# EAGLE schematic openEMSstim_02 (EAGLE 7.6.0)
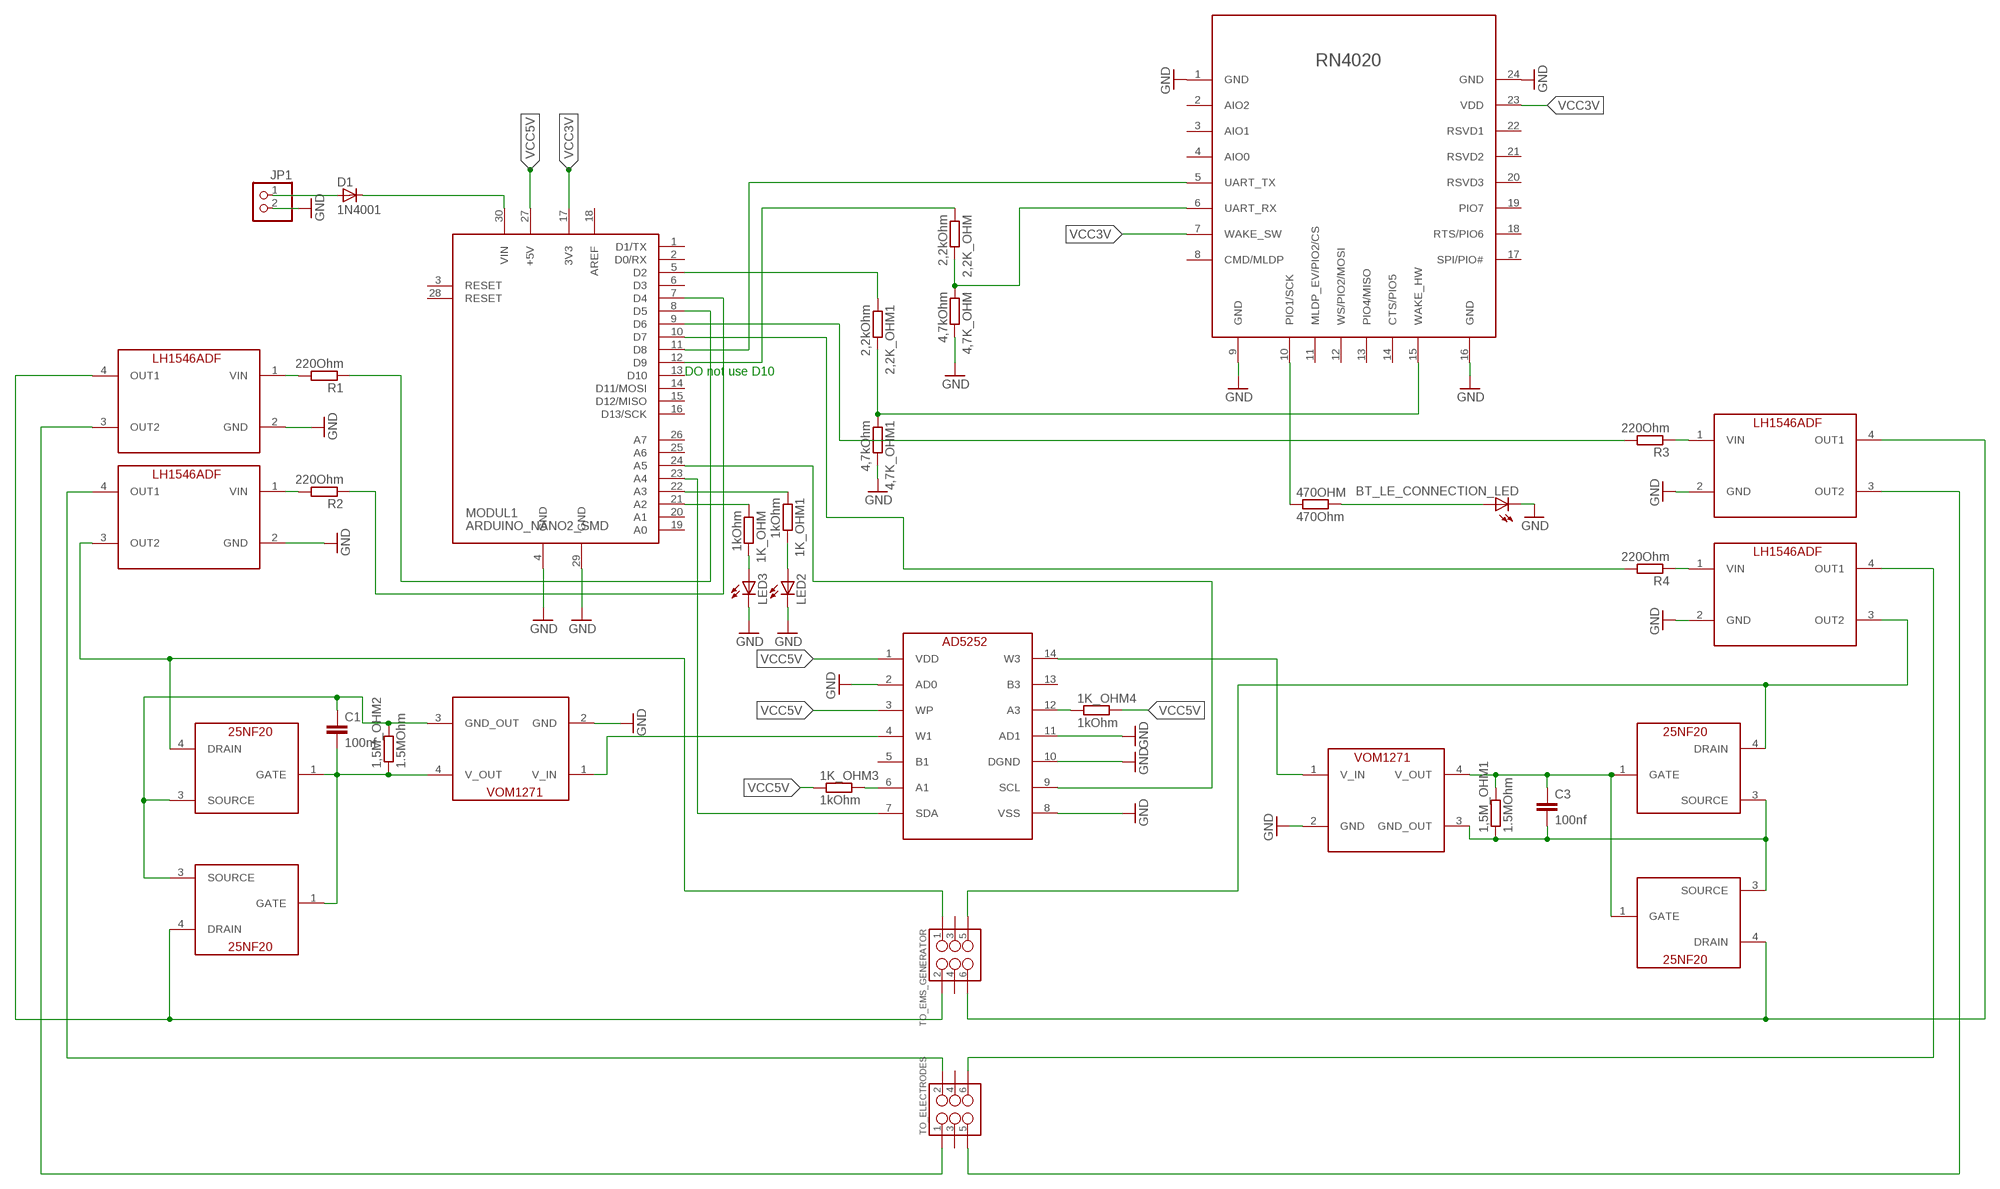
[diagram p0: schematic, sheet 1]

## Parts
1,5M_OHM1  1.5MOhm  R-EU_R0805  [R0805]
1,5M_OHM2  1.5MOhm  R-EU_R0805  [R0805]
1K_OHM  1kOhm  R-EU_R0805  [R0805]
1K_OHM1  1kOhm  R-EU_R0805  [R0805]
1K_OHM3  1kOhm  R-EU_R0805  [R0805]
1K_OHM4  1kOhm  R-EU_R0805  [R0805]
2,2K_OHM  2,2kOhm  R-EU_R0805  [R0805]
2,2K_OHM1  2,2kOhm  R-EU_R0805  [R0805]
4,7K_OHM  4,7kOhm  R-EU_R0805  [R0805]
4,7K_OHM1  4,7kOhm  R-EU_R0805  [R0805]
470OHM  470Ohm  R-EU_R0805  [R0805]
BT_LE_CONNECTION_LED  LEDCHIPLED_0603  [CHIPLED_0603]
C1  100nf  CAP0805  [0805]
C3  100nf  CAP0805  [0805]
D1  1N4001  D-SMB  [SMB]
JP1  PINHD-1X2  [1X02]
LED2  LEDCHIPLED_0603  [CHIPLED_0603]
LED3  LEDCHIPLED_0603  [CHIPLED_0603]
MODUL1  ARDUINO_NANO2_SMD  [ARDUINO_NANO2_SMD]
MOS01  DEV  [PACK]
MOS02  DEV  [PACK]
MOS03  DEV  [PACK]
MOS04  DEV  [PACK]
R1  220Ohm  R-EU_R0805  [R0805]
R2  220Ohm  R-EU_R0805  [R0805]
R3  220Ohm  R-EU_R0805  [R0805]
R4  220Ohm  R-EU_R0805  [R0805]
TO_ELECTRODES  M03X2  [RIGHT_ANGLED_SHROUED_2X06_6PIN]
TO_EMS_GENERATOR  M03X2  [RIGHT_ANGLED_SHROUED_2X06_6PIN]
U$5  RN4020  [RN4020]
U$6  AD5252  [TSSOP]
U$9  VOM1271  [SOP04]
U$10  VOM1271  [SOP04]
U$11  LH1546ADF  [DIP04-SMD]
U$12  LH1546ADF  [DIP04-SMD]
U$13  LH1546ADF  [DIP04-SMD]
U$14  LH1546ADF  [DIP04-SMD]

## Nets
GND: 4,7K_OHM1.2 4,7K_OHM.2 BT_LE_CONNECTION_LED.C JP1.2 LED2.C LED3.C MODUL1.4(GND) MODUL1.29(GND) U$5.1(GND) U$5.9(GND) U$5.16(GND) U$5.24(GND) U$6.2(AD0) U$6.8(VSS) U$6.10(DGND) U$6.11(AD1) U$9.2(GND) U$10.2(GND) U$11.2(GND) U$12.2(GND) U$13.2(GND) U$14.2(GND)
N$1: U$6.4(W1) U$9.1(V_IN)
N$2: 1K_OHM.1 MODUL1.21(A2)
N$3: MODUL1.23(A4) U$6.7(SDA)
N$4: TO_ELECTRODES.6 U$14.4(OUT1)
N$5: 2,2K_OHM.2 4,7K_OHM.1 U$5.6(UART_RX)
N$6: 2,2K_OHM.1 MODUL1.12(D9)
N$7: TO_ELECTRODES.1 U$11.3(OUT2)
N$8: 1,5M_OHM2.1 C1.2 MOS01.1(GATE) MOS02.1(GATE) U$9.4(V_OUT)
N$9: MODUL1.11(D8) U$5.5(UART_TX)
N$10: MODUL1.24(A5) U$6.9(SCL)
N$11: D1.1(C) MODUL1.30(VIN)
N$12: R2.2 U$12.1(VIN)
N$13: TO_ELECTRODES.2 U$12.4(OUT1)
N$14: R1.2 U$11.1(VIN)
N$15: R3.1 U$13.1(VIN)
N$16: R4.1 U$14.1(VIN)
N$17: MODUL1.8(D5) R1.1
N$18: MODUL1.7(D4) R2.1
N$19: MODUL1.9(D6) R3.2
N$20: MODUL1.10(D7) R4.2
N$21: MOS01.4(DRAIN) TO_EMS_GENERATOR.1 U$12.3(OUT2)
N$22: U$6.14(W3) U$10.1(V_IN)
N$23: 1,5M_OHM1.2 C3.1 MOS03.1(GATE) MOS04.1(GATE) U$10.4(V_OUT)
N$24: 1,5M_OHM1.1 C3.2 MOS03.3(SOURCE) MOS04.3(SOURCE) U$10.3(GND_OUT)
N$26: 1K_OHM4.1 U$6.12(A3)
N$27: 1,5M_OHM2.2 C1.1 MOS01.3(SOURCE) MOS02.3(SOURCE) U$9.3(GND_OUT)
N$28: MOS03.4(DRAIN) TO_EMS_GENERATOR.5 U$14.3(OUT2)
N$30: MOS02.4(DRAIN) TO_EMS_GENERATOR.2 U$11.4(OUT1)
N$31: TO_ELECTRODES.5 U$13.3(OUT2)
N$32: MOS04.4(DRAIN) TO_EMS_GENERATOR.6 U$13.4(OUT1)
N$33: 2,2K_OHM1.2 4,7K_OHM1.1 U$5.15(WAKE_HW)
N$34: 1K_OHM3.2 U$6.6(A1)
N$35: 2,2K_OHM1.1 MODUL1.5(D2)
N$36: 470OHM.1 U$5.10(PIO1/SCK)
N$37: 470OHM.2 BT_LE_CONNECTION_LED.A
N$39: 1K_OHM1.2 LED2.A
N$40: 1K_OHM1.1 MODUL1.22(A3)
N$42: 1K_OHM.2 LED3.A
N$63: D1.2(A) JP1.1
VCC3V: MODUL1.17(3V3) U$5.7(WAKE_SW) U$5.23(VDD)
VCC5V: 1K_OHM3.1 1K_OHM4.2 MODUL1.27(+5V) U$6.1(VDD) U$6.3(WP)
Unconnected: MODUL1.1(D1/TX) MODUL1.2(D0/RX) MODUL1.3(RESET) MODUL1.6(D3) MODUL1.13(D10) MODUL1.14(D11/MOSI) MODUL1.15(D12/MISO) MODUL1.16(D13/SCK) MODUL1.19(A0) MODUL1.20(A1) MODUL1.25(A6) MODUL1.26(A7) MODUL1.28(RESET) TO_ELECTRODES.3 TO_ELECTRODES.4 TO_EMS_GENERATOR.3 TO_EMS_GENERATOR.4 U$5.2(AIO2) U$5.3(AIO1) U$5.4(AIO0) U$5.8(CMD/MLDP) U$5.11(MLDP_EV/PIO2/CS) U$5.12(WS/PIO2/MOSI) U$5.13(PIO4/MISO) U$5.14(CTS/PIO5) U$5.17(SPI/PIO#) U$5.18(RTS/PIO6) U$5.19(PIO7) U$5.20(RSVD3) U$5.21(RSVD2) U$5.22(RSVD1) U$6.5(B1) U$6.13(B3)

## Notes on the sheet
- DO not use D10

## Power pins joined to a net without a drawn wire
AREF: MODUL1.18(AREF)

## Library data of the parts
1,5M_OHM1 1,5M_OHM2 1K_OHM 1K_OHM1 1K_OHM3 1K_OHM4 2,2K_OHM 2,2K_OHM1 4,7K_OHM 4,7K_OHM1 470OHM R1-R4 = resistor:R-EU_: RESISTOR, European symbol
BT_LE_CONNECTION_LED LED2 LED3 = adafruit:LED: LED OSRAM: - CHIPLED LG R971, LG N971, LY N971, LG Q971, LY Q971, LO R971, LY R971 LH N974, LH R974 LS Q976, LO Q976, LY Q976 LO Q996 - Hyper CHIPLED LW Q18S LB Q993, LB Q99A, LB R99A - SideLED LS A670, LO A670, LY A670, LG A670, LP A670 LB A673, LV A673, LT A673, LW A673 LH A674 LY A675 LS A676, LA A676, LO A676, LY A676, LW A676 LS A679, LY A679, LG A679 - Hyper Micro SIDELED® LS Y876, LA Y876, LO Y876, LY Y876 LT Y87S - SmartLED LW L88C, LW L88S LB L89C, LB L89S, LG L890 LS L89K, LO L89K, LY L89K LS L896, LA L896, LO L896, LY L896 - TOPLED LS T670, LO T670, LY T670, LG T670, LP T670 LSG T670, LSP T670, LSY T670, LOP T670, LYG T670 LG T671, LOG T671, LSG T671 LB T673, LV T673, LT T673, LW T673 LH T674 LS T676, LA T676, LO T676, LY T676, LB T676, LH T676, LSB T676, LW T676 LB T67C, LV T67C, LT T67C, LS T67K, LO T67K, LY T67K, LW E67C LS E67B, LA E67B, LO E67B, LY E67B, LB E67C, LV E67C, LT E67C LW T67C LS T679, LY T679, LG T679 LS T770, LO T770, LY T770, LG T770, LP T770 LB T773, LV T773, LT T773, LW T773 LH T774 LS E675, LA E675, LY E675, LS T675 LS T776, LA T776, LO T776, LY T776, LB T776 LHGB T686 LT T68C, LB T68C - Hyper Mini TOPLED® LB M676 - Mini TOPLED Santana® LG M470 LS M47K, LO M47K, LY M47K Source: http://www.osram.convergy.de/
C1 C3 = SparkFun-Passives:CAP: Capacitor Standard 0603 ceramic capacitor, and 0.1" leaded capacitor.
D1 = semicon-smd-ipc:D-: DIODE unfilled
JP1 = pinhead:PINHD-1X2: PIN HEADER
MODUL1 = arduino:ARDUINO_NANO2_SMD
MOS01-MOS04 = Tim:DEV
TO_ELECTRODES TO_EMS_GENERATOR = Tim:M03X2: 2x3 .1" header. Shrouded, with keying- CONN-10681 SMT- CONN-11415 Pogo pins- HW-11044
U$5 = microchip:RN4020
U$6 = Tim:AD5252
U$9 U$10 = Tim:VOM1271
U$11-U$14 = Tim:LH1546ADF